# EAGLE design atmega328_breakout (EAGLE 6.5.0)
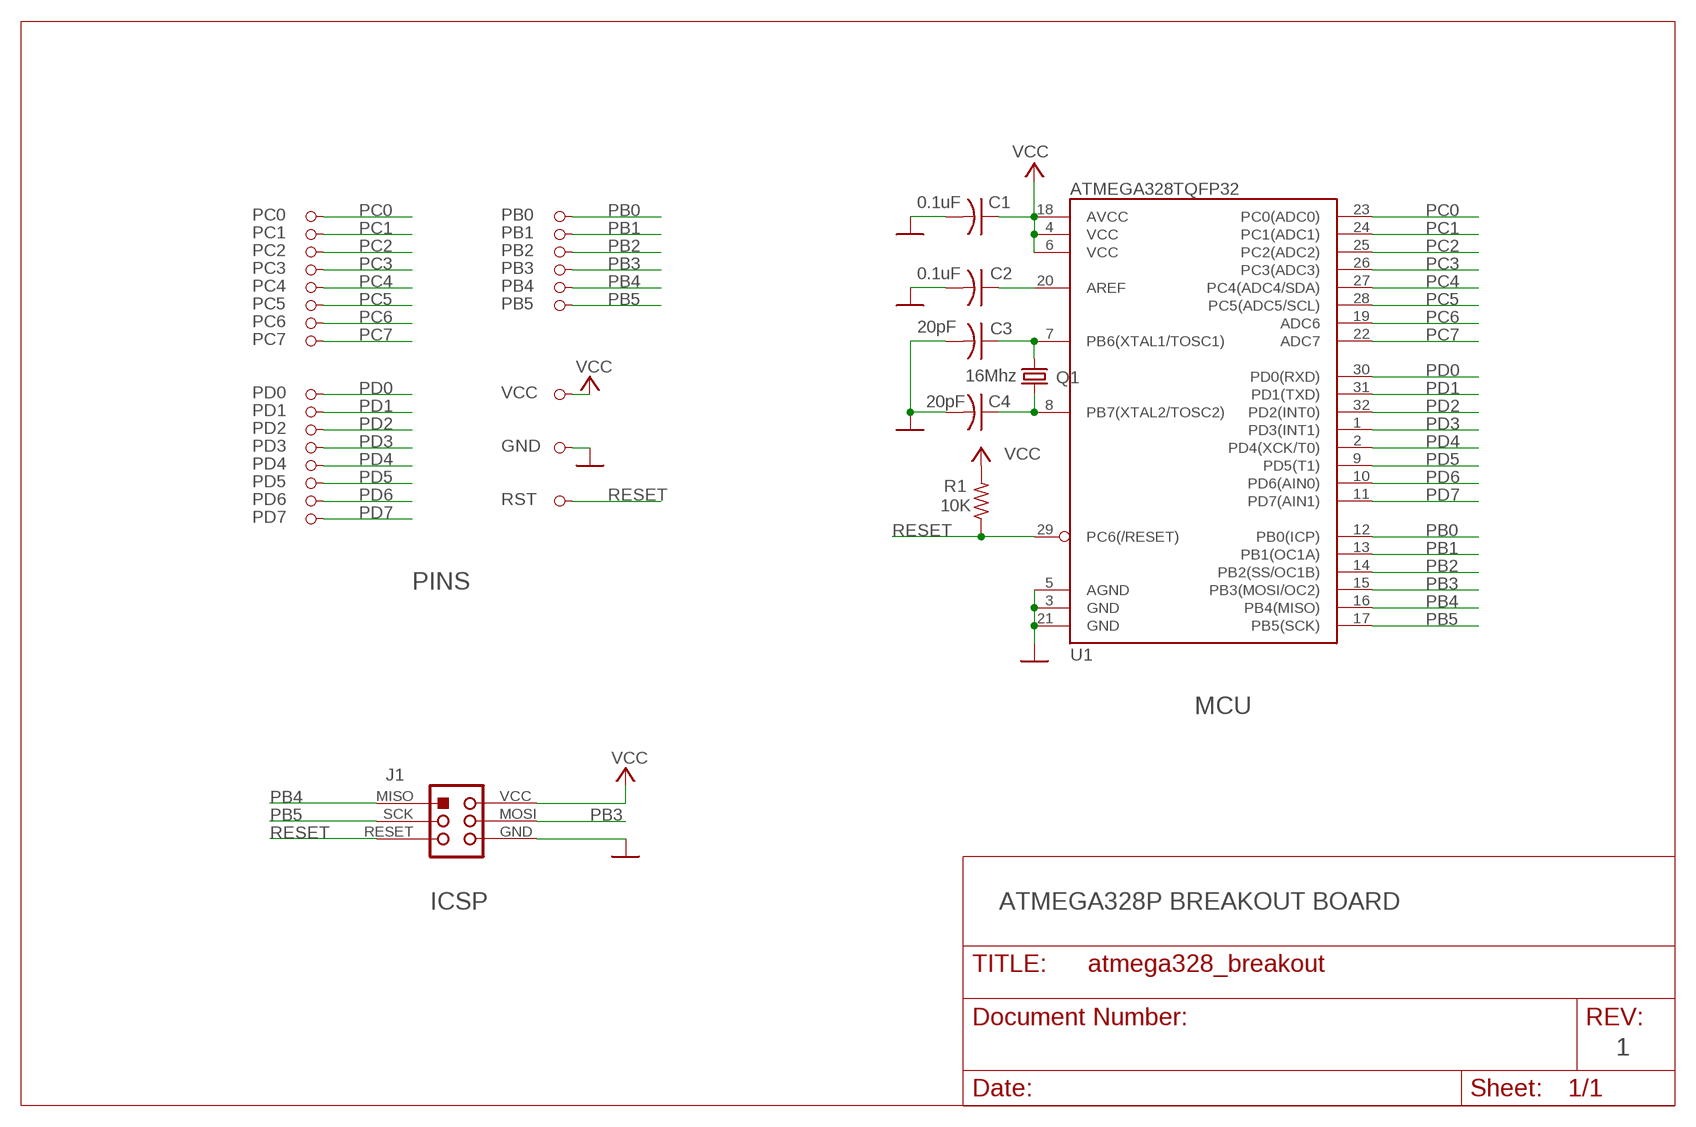
[diagram p0: schematic, sheet 1]

## Parts
C1  0.1uF  CAP-C0603  [C0603]
C2  0.1uF  CAP-C0603  [C0603]
C3  20pF  CAP-C0603  [C0603]
C4  20pF  CAP-C0603  [C0603]
GND  PINHD-1X1  [1X01]
J1  ICSP  [ICSP]
PB0  PINHD-1X1  [1X01]
PB1  PINHD-1X1  [1X01]
PB2  PINHD-1X1  [1X01]
PB3  PINHD-1X1  [1X01]
PB4  PINHD-1X1  [1X01]
PB5  PINHD-1X1  [1X01]
PC0  PINHD-1X1  [1X01]
PC1  PINHD-1X1  [1X01]
PC2  PINHD-1X1  [1X01]
PC3  PINHD-1X1  [1X01]
PC4  PINHD-1X1  [1X01]
PC5  PINHD-1X1  [1X01]
PC6  PINHD-1X1  [1X01]
PC7  PINHD-1X1  [1X01]
PD0  PINHD-1X1  [1X01]
PD1  PINHD-1X1  [1X01]
PD2  PINHD-1X1  [1X01]
PD3  PINHD-1X1  [1X01]
PD4  PINHD-1X1  [1X01]
PD5  PINHD-1X1  [1X01]
PD6  PINHD-1X1  [1X01]
PD7  PINHD-1X1  [1X01]
Q1  16Mhz  CRYSTALCTS406  [CRYSTAL-CTS406]
R1  10K  RES-R0603  [R0603]
RST  PINHD-1X1  [1X01]
U1  ATMEGA328TQFP32  [TQFP32-08]
VCC  PINHD-1X1  [1X01]

## Nets
AREF: C2.1 U1.20(AREF)
GND: C1.2 C2.2 C3.2 C4.2 GND.1 J1.GND U1.3(GND) U1.5(AGND) U1.21(GND)
N$2: C3.1 Q1.1 U1.7(PB6(XTAL1/TOSC1))
N$7: C4.1 Q1.3 U1.8(PB7(XTAL2/TOSC2))
PB0: PB0.1 U1.12(PB0(ICP))
PB1: PB1.1 U1.13(PB1(OC1A))
PB2: PB2.1 U1.14(PB2(SS/OC1B))
PB3: J1.MOSI PB3.1 U1.15(PB3(MOSI/OC2))
PB4: J1.MISO PB4.1 U1.16(PB4(MISO))
PB5: J1.SCK PB5.1 U1.17(PB5(SCK))
PC0: PC0.1 U1.23(PC0(ADC0))
PC1: PC1.1 U1.24(PC1(ADC1))
PC2: PC2.1 U1.25(PC2(ADC2))
PC3: PC3.1 U1.26(PC3(ADC3))
PC4: PC4.1 U1.27(PC4(ADC4/SDA))
PC5: PC5.1 U1.28(PC5(ADC5/SCL))
PC6: PC6.1 U1.19(ADC6)
PC7: PC7.1 U1.22(ADC7)
PD0: PD0.1 U1.30(PD0(RXD))
PD1: PD1.1 U1.31(PD1(TXD))
PD2: PD2.1 U1.32(PD2(INT0))
PD3: PD3.1 U1.1(PD3(INT1))
PD4: PD4.1 U1.2(PD4(XCK/T0))
PD5: PD5.1 U1.9(PD5(T1))
PD6: PD6.1 U1.10(PD6(AIN0))
PD7: PD7.1 U1.11(PD7(AIN1))
RESET: J1.RESET R1.1 RST.1 U1.29(PC6(/RESET))
VCC: C1.1 J1.VCC R1.2 U1.4(VCC) U1.6(VCC) U1.18(AVCC) VCC.1

## Notes on the sheet
- PINS
- MCU
- ICSP | ATMEGA328P BREAKOUT BOARD
- 1

## Library data of the parts
C1-C4 = atmega328_breakout:CAP-: CAPACITOR, American symbol
GND PB0 PB1-PB5 PC0 PC1-PC7 PD0 PD1-PD7 RST VCC = atmega328_breakout:PINHD-1X1: PIN HEADER
J1 = atmega328_breakout:ICSP
Q1 = atmega328_breakout:CRYSTAL: CRYSTAL; OC_FARNELL: unknown; OC_NEWARK: unknown
R1 = atmega328_breakout:RES-: RESISTOR, American symbol
U1 = atmega328_breakout:ATMEGA328

## Net classes
1 power: width 0.254 mm

## Board
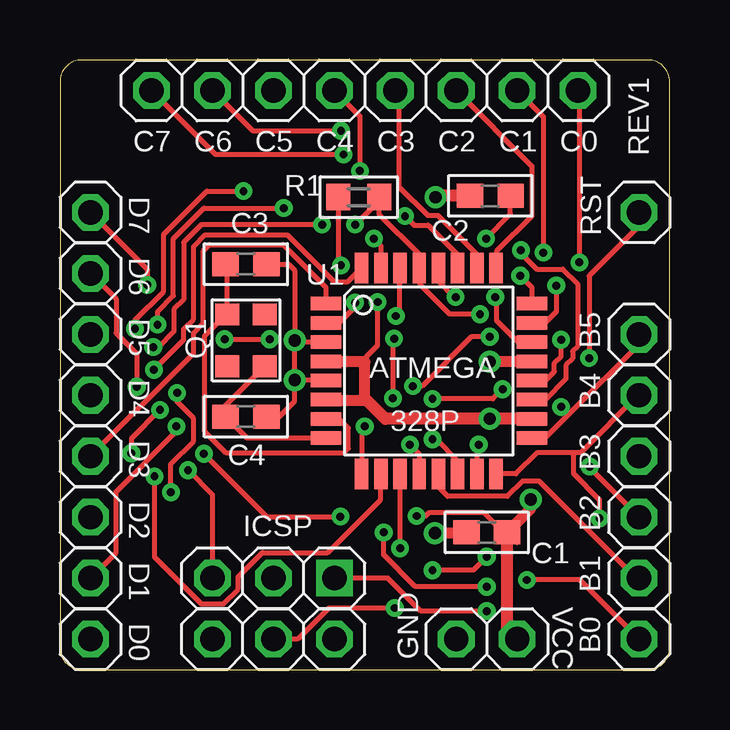
[diagram p1: board, top side]
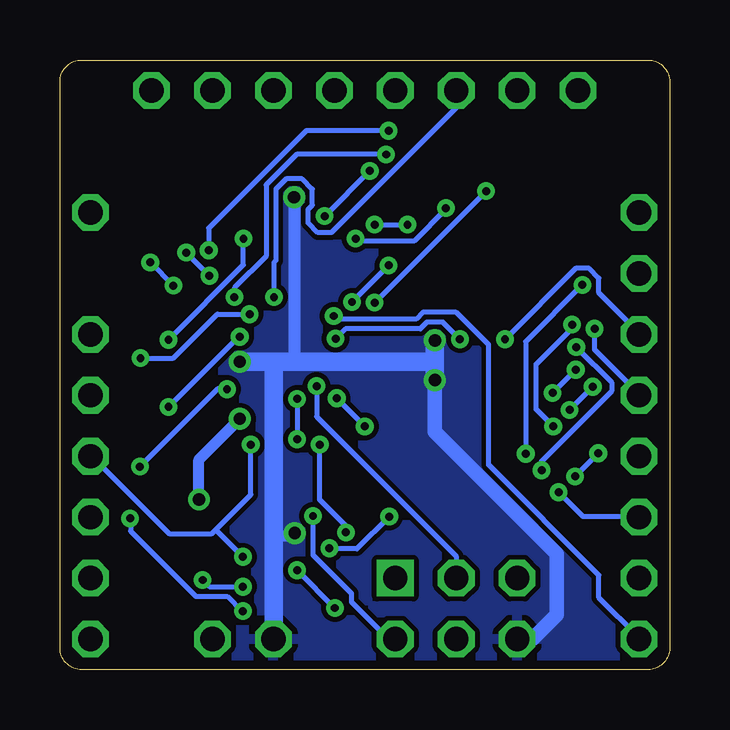
[diagram p2: board, bottom side, seen from below]

Size 25.4 x 25.4 mm. Coordinates in mm from the lower left corner, seen from the top.
Outline: 0.9,0 24.5,0 arc90 25.4,0.9 25.4,24.5 arc90 24.5,25.4 0.9,25.4 arc90 0,24.5 0,0.9 arc90 0.9,0
Copper layers (1*16): Top 0.035mm / dielectric 1.5mm / Bottom 0.035mm
Design rules "default *": minimum track width 8mil, minimum drill 13mil, track to track 8mil, track to pad 8mil, pad to pad 8mil, via to via 8mil, smd to smd 8mil, copper to edge 15mil, drill to drill 8mil, minimum pad ring 10mil, minimum via ring 8mil, stop-mask expansion 4mil, vias tented up to drill 20mil, thermal gap 10mil

### Footprints (pad centres in the part's own frame; a part is rotated, then mirrored left to right if it is on the bottom)
C0603 = smd 1.1 x 1: 1 -0.85,0; 2 0.85,0
1X01 = drill 1.016 octagon: 1 0,0
ICSP = drill 1.016 octagon: GND 2.54,1.27; MOSI 0,1.27; RESET 2.54,-1.27; SCK 0,-1.27; VCC -2.54,1.27 | drill 1.016 square: MISO -2.54,-1.27
CRYSTAL-CTS406 = smd 0.9 x 1: 1 -1.075,-0.775; 2 1.075,-0.775; 3 1.075,0.775; 4 -1.075,0.775
R0603 = smd 1 x 1.1: 1 -0.85,0; 2 0.85,0
TQFP32-08 = smd 1.27 x 0.559: 1 -4.293,2.8; 2 -4.293,2; 3 -4.293,1.2; 4 -4.293,0.4; 5 -4.293,-0.4; 6 -4.293,-1.2; 7 -4.293,-2; 8 -4.293,-2.8; 17 4.293,-2.8; 18 4.293,-2; 19 4.293,-1.2; 20 4.293,-0.4; 21 4.293,0.4; 22 4.293,1.2; 23 4.293,2; 24 4.293,2.8 | smd 0.559 x 1.27: 9 -2.8,-4.293; 10 -2,-4.293; 11 -1.2,-4.293; 12 -0.4,-4.293; 13 0.4,-4.293; 14 1.2,-4.293; 15 2,-4.293; 16 2.8,-4.293; 25 2.8,4.293; 26 2,4.293; 27 1.2,4.293; 28 0.4,4.293; 29 -0.4,4.293; 30 -1.2,4.293; 31 -2,4.293; 32 -2.8,4.293

### Placement (x,y rotation side)
C1  17.78,5.71 180 top
C2  17.93,19.74 180 top
C3  7.75,16.89 0 top
C4  7.75,10.54 0 top
GND  16.51,1.27 0 top
J1  8.89,2.54 180 top
PB0  24.13,1.27 0 top
PB1  24.13,3.81 0 top
PB2  24.13,6.35 0 top
PB3  24.13,8.89 0 top
PB4  24.13,11.43 0 top
PB5  24.13,13.97 0 top
PC0  21.59,24.13 0 top
PC1  19.05,24.13 0 top
PC2  16.51,24.13 0 top
PC3  13.97,24.13 0 top
PC4  11.43,24.13 0 top
PC5  8.89,24.13 0 top
PC6  6.35,24.13 0 top
PC7  3.81,24.13 0 top
PD0  1.27,1.27 0 top
PD1  1.27,3.81 0 top
PD2  1.27,6.35 0 top
PD3  1.27,8.89 0 top
PD4  1.27,11.43 0 top
PD5  1.27,13.97 0 top
PD6  1.27,16.51 0 top
PD7  1.27,19.05 0 top
Q1  7.75,13.72 270 top
R1  12.45,19.68 180 top
RST  24.13,19.05 0 top
U1  15.37,12.45 0 top
VCC  19.05,1.27 0 top

### Tracks (layer width: path | path; a pad name or v marks a point on that pad's centre or on a via)
AREF  (via drill 0.33)
  Top 0.203: v17.75,17.96 18.77,18.97 C2.1 | v20.88,13.74 20.88,13.06 20.6,12.78 20.6,12.42 20.24,12.07 19.66,12.07 U1.20
  Bottom 0.203: v17.75,17.96 17.75,16.87 v20.88,13.74
GND  (via drill 0.51)
  Top 0.203: C3.2 9.53,16.89 9.78,16.64 v9.78,13.72 | U1.5 11.05,12.07 v9.78,12.07 | U1.3 9.85,13.65 v9.78,13.72 | C4.2 9.14,10.54 9.78,11.18 v9.78,12.07 | v9.78,12.07 v9.78,13.72
  Top 0.457: U1.21 19.64,12.83 v17.91,12.83 | C1.2 16.91,5.69 v15.62,5.69
  Top 0.508: C2.2 15.7,19.74 v15.65,19.68
  Bottom 0.457: GND.1 16.48,1.29 | v15.62,5.69 15.75,5.56 16.48,5.56
  Bottom 0.508: v15.65,19.68 15.65,12.95 15.52,12.83
  Bottom 0.61: J1.GND 5.71,1.27 4.7,2.29 4.7,4.83 9.78,9.91 v9.78,12.07
  Bottom 0.762: v9.78,12.07 9.78,12.83 | 9.78,12.83 v9.78,13.72 | 17.93,12.85 v17.91,12.83 16.48,12.83 | 16.48,12.83 15.52,12.83 9.78,12.83 | 16.48,1.29 16.48,5.56 16.48,12.83
  pour Bottom: 0,0 0,25.4 25.4,25.4 25.4,0
N$2
  Top 0.203: C3.1 6.97,16.82 Q1.1 6.88,14.76 6.02,13.89 6.02,9.93 6.91,9.04 11.84,9.04 12.01,9.22 12.01,10.06 11.63,10.44 11.07,10.44 U1.7
N$7
  Top 0.203: 8.6,12.57 Q1.3 6.9,11.02 C4.1 7.79,9.65 U1.8
PB0  (via drill 0.33)
  Top 0.203: v14.58,9.37 14.96,8.99 U1.12 | v13.49,5.71 13.49,4.78 14.81,3.45 v17.78,3.45 | v19.46,3.73 21.67,3.73 PB0.1
  Bottom 0.203: v14.58,9.37 14.58,7.09 13.49,5.99 v13.49,5.71 | v17.78,3.45 19.18,3.45 v19.46,3.73
PB1
  Top 0.203: PB1.1 24,3.81 19.96,7.85 19.28,7.85 18.64,7.21 16.15,7.21 15.77,7.6 U1.13
PB2  (via drill 0.33)
  Top 0.203: v15.52,9.6 15.67,9.6 16.56,8.71 U1.14 | v15.52,11.28 18.03,11.28 v18.44,11.68 | v22.07,8.46 22.07,8.41 PB2.1
  Bottom 0.203: v15.52,11.28 v15.52,9.6 | v18.44,11.68 18.47,11.71 18.82,11.71 v22.07,8.46
PB3  (via drill 0.33)
  Top 0.203: v17.45,9.37 17.37,9.3 U1.15 | J1.MOSI 9.91,1.27 11.2,2.56 v13.95,2.56 | v15.52,4.14 17.22,4.14 v17.78,4.7
  Bottom 0.203: v17.45,9.37 17.45,7.29 18.91,5.83 | 18.91,5.83 19.07,5.66 20.85,5.66 24.08,8.89 PB3.1 | v15.52,4.14 v13.95,2.56 | 18.91,5.83 v17.78,4.7
PB4  (via drill 0.33)
  Top 0.203: U1.16 19,8.15 19.89,9.04 21.39,9.04 | 21.39,9.04 21.69,9.04 24.08,11.43 PB4.1 | J1.MISO 13.67,3.81 15.04,2.44 v17.78,2.44 | v22.48,6.3 22.48,7.09 21.39,8.18 21.39,9.04
  Bottom 0.203: v17.78,2.44 17.83,2.44 18.44,3.05 19.74,3.05 22.45,5.77 22.45,6.27 v22.48,6.3
PB5  (via drill 0.33)
  Top 0.203: 21.2,10.63 24.13,13.56 PB5.1 | 21.2,10.63 20.22,9.65 U1.17 | v14.71,11.81 15.09,11.81 17.14,13.87 v17.91,13.87 | 21.2,10.63 v20.88,10.95
  Bottom 0.203: J1.SCK 8.89,4.72 14.71,10.54 v14.71,11.81 | v17.91,13.87 17.96,13.87 v20.88,10.95
PC0  (via drill 0.33)
  Top 0.203: v20.68,16 20.68,14.91 20.22,14.45 U1.23 | v21.64,16.97 21.64,24.08 PC0.1
  Bottom 0.203: v21.64,16.97 v20.68,16
PC1  (via drill 0.33)
  Top 0.203: U1.24 19.66,15.93 v19.18,16.41 | v20.14,17.37 20.14,23.04 PC1.1
  Bottom 0.203: v20.14,17.37 v19.18,16.41
PC2
  Top 0.203: PC2.1 19.66,20.98 19.66,18.9 18.19,17.42 18.19,16.74 U1.25
PC3
  Top 0.203: PC3.1 14.12,23.98 14.12,20.12 15.32,18.92 15.75,18.92 17.35,17.32 17.35,16.74 U1.26
PC4  (via drill 0.33)
  Top 0.203: v14.38,18.9 14.76,18.52 15.34,18.52 16.56,17.3 U1.27 | v12.5,20.78 12.5,23.06 PC4.1
  Bottom 0.203: v12.5,20.78 v14.38,18.9
PC5  (via drill 0.33)
  Top 0.203: v16.48,15.52 16.43,15.52 15.77,16.18 U1.28
  Bottom 0.203: v16.48,15.52 16.48,16.97 16.41,17.04 16.41,20.02 15.98,20.45 15.32,20.45 14.88,20.02 14.88,19.36 15.06,19.18 15.06,18.62 14.66,18.21 14.1,18.21 8.89,23.42 PC5.1
PC6  (via drill 0.33)
  Top 0.203: v19.2,17.48 19.2,17.35 19.86,16.69 20.96,16.69 21.57,16.08 21.57,13.46 21.36,13.26 21.36,12.95 21.08,12.68 21.08,12.12 20.22,11.25 U1.19 | v11.71,22.45 8.03,22.45 PC6.1
  Bottom 0.203: v19.2,17.48 19.2,18.39 15.14,22.45 v11.71,22.45
PC7  (via drill 0.33)
  Top 0.203: v18.14,15.52 18.19,15.47 18.19,14.55 19.07,13.67 19.66,13.67 U1.22 | v11.81,21.46 6.48,21.46 PC7.1
  Bottom 0.203: v18.14,15.52 18.14,15.9 16.82,17.22 16.82,20.19 15.55,21.46 v11.81,21.46
PD0  (via drill 0.33)
  Top 0.203: v14,14.73 14.15,14.88 14.15,16.74 U1.30
  Bottom 0.203: v14,14.73 13.87,14.61 10.57,14.61 10.29,14.88 8.89,14.88 7.54,13.54 7.54,8.53 2.95,3.94 2.95,3 1.27,1.32 PD0.1
PD1  (via drill 0.33)
  Top 0.203: v13.08,17.96 13.36,17.68 U1.31 | v9.32,19.23 5.99,19.23 4.72,17.96 4.72,15.57 4.06,14.91 v4.06,14.38 | v4.85,10.13 4.85,9.93 2.34,7.42 2.34,4.88 PD1.1
  Bottom 0.203: v13.08,17.96 12.98,17.86 10.64,17.86 9.32,19.18 v9.32,19.23 | v4.06,14.38 4.06,14.22 5.56,12.72 5.56,10.85 v4.85,10.13
PD2  (via drill 0.33)
  Top 0.203: v3.91,12.5 5.16,13.74 5.16,14.2 5.56,14.61 5.56,17.63 6.04,18.11 9.47,18.11 11.43,16.15 11.99,16.15 12.39,16.56 12.39,16.59 12.55,16.74 U1.32 | v4.88,11.53 4.88,11.15 5.56,10.46 5.56,9.53 4.62,8.59 v4.62,7.39
  Bottom 0.203: v4.88,11.53 v3.91,12.5 | v4.62,7.39 3.61,6.38 1.29,6.38 PD2.1
PD3
  Top 0.203: U1.1 11.07,15.93 9.3,17.7 6.22,17.7 5.97,17.45 5.97,14.43 5.56,14.02 5.56,13.18 PD3.1
PD4  (via drill 0.33)
  Top 0.203: v12.29,15.29 12.29,15.11 11.63,14.45 U1.2 | v7.64,19.94 6.12,19.94 4.32,18.14 4.32,15.75 3.12,14.55 v3.12,14.2
  Bottom 0.203: v7.64,19.94 v12.29,15.29 | v3.12,14.2 3.12,13.34 1.27,11.48 PD4.1
PD5  (via drill 0.33)
  Top 0.203: v12.7,10.13 12.57,10.01 U1.9 | v13.87,11.3 13.87,13.74 v13.92,13.79 | v6.86,13.77 v8.74,13.77
  Bottom 0.203: v13.87,11.3 v12.7,10.13 | v13.92,13.79 13.51,14.2 10.39,14.2 10.11,14.48 9.45,14.48 v8.74,13.77 | v6.86,13.77 3.91,16.71 3.35,16.71 2.95,16.31 2.95,15.7 1.27,14.02 PD5.1
PD6  (via drill 0.33)
  Top 0.203: v3.94,8.05 3.94,4.7 5.89,2.74 6.81,2.74 7.42,3.35 7.42,3.86 8.43,4.88 11.15,4.88 13.36,7.09 U1.10 | v2.97,9.02 2.97,9.63 v4.17,10.82 | v3.2,11.79 3.2,13.16 2.34,14.02 2.34,15.44 PD6.1
  Bottom 0.203: v2.97,9.02 v3.94,8.05 | v3.2,11.79 v4.17,10.82
PD7  (via drill 0.33)
  Top 0.203: v14.17,5.05 U1.11 | v11.68,6.38 8.61,6.38 v5.99,8.99 | v3.63,16.03 3.63,16.69 PD7.1
  Bottom 0.203: v14.17,5.05 14.15,5.03 13.03,5.03 v11.68,6.38 | v5.99,8.99 5.99,13.67 v3.63,16.03
RESET  (via drill 0.33)
  Top 0.203: v17.5,14.81 16.23,14.81 15.01,16.03 15.01,16.66 U1.29 14.96,17.3 13.31,18.95 R1.1 13.23,19.48 v12.29,18.54 | v22.05,12.98 22.05,16.41 24.13,18.49 RST.1 | J1.RESET 6.35,7.29 v5.33,8.31 | v3.89,13.44 4.09,13.44 4.75,14.1 4.75,15.01 5.16,15.42 5.16,17.8 5.89,18.54 v10.92,18.54
  Bottom 0.203: v17.5,14.81 18.85,14.81 20.68,12.98 v22.05,12.98 | v5.33,8.31 5.33,8.69 2.41,11.61 2.41,11.96 v3.89,13.44 | v12.29,18.54 v10.92,18.54
VCC  (via drill 0.33, 0.51)
  Top 0.203: 11.14,11.18 U1.6 | 12.7,12.83 12.68,12.85 12.78,13.06 13.23,13.51 v13.23,15.32 | 19.05,5.29 C1.1 18.39,5.82 17.68,6.53 15.37,6.53 15.24,6.4 v14.86,6.4 | v11.71,16.84 11.61,16.94 R1.2
  Top 0.457: U1.4 12.68,12.85 | U1.6 11.09,11.23 12.78,11.23 12.7,11.3 12.7,12.83 | v19.61,7.09 19.61,6.69 C1.1
  Top 0.508: U1.18 v17.91,10.45 13.56,10.45 12.78,11.23 | VCC.1 18.63,1.69 C1.1
  Bottom 0.203: v13.23,15.32 v11.71,16.84 | J1.VCC 11.71,1.27 13.26,2.82 13.26,3.18 14.86,4.78 v14.86,6.4
  Bottom 0.457: v19.61,7.09 19.61,8.74 v17.91,10.45

### Text on the board
tPlace: REV1 | C7 | C6 | C5 | C4 | C3 | C2 | C1 | C0 | D7 | D6 | D5 | B5 | D4 | ATMEGA | B4 | 328P | D3 | B3 | B2 | D2 | ICSP | D1 | B1 | B0 | D0